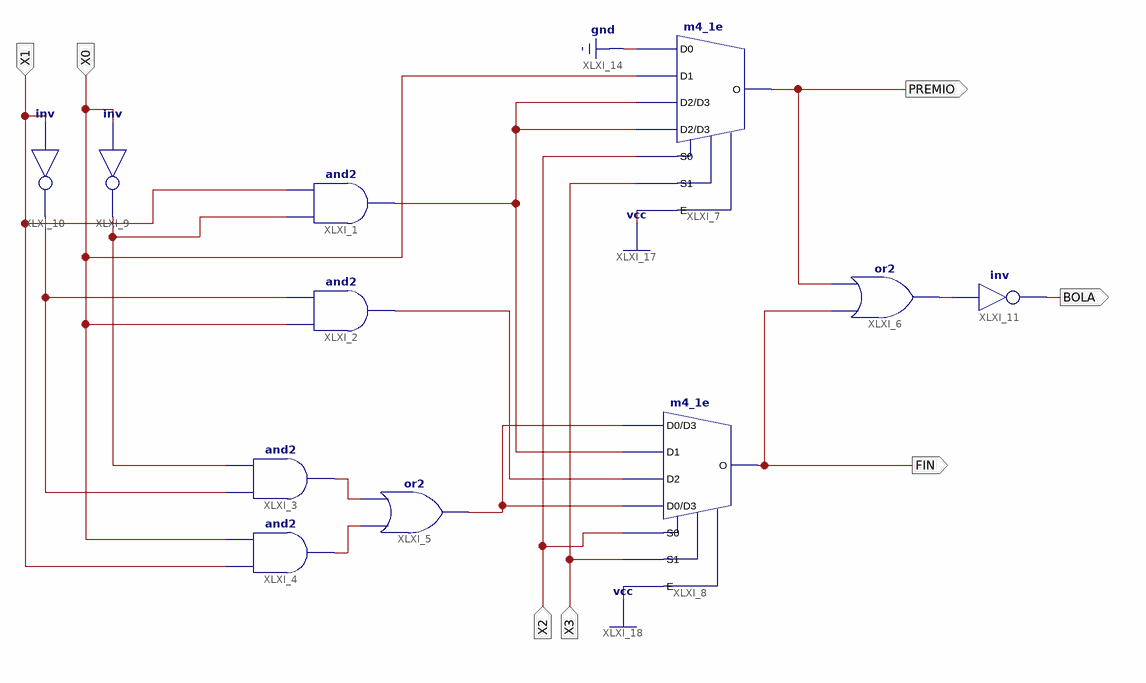
[diagram p0: schematic sheet 1]
// Xilinx ISE schematic p2ej2_montaje.sch (spartan3) as structural Verilog: 11 symbols, 7 ports
module p2ej2_montaje (
  input  X1,
  input  X0,
  input  X2,
  input  X3,
  output PREMIO,
  output FIN,
  output BOLA
);

  wire XLXN_2, XLXN_3, XLXN_7, XLXN_11, XLXN_12, XLXN_14, XLXN_16, XLXN_18;

  and XLXI_1 (XLXN_14, XLXN_12, X1);
  and XLXI_2 (XLXN_16, X0, XLXN_11);
  and XLXI_3 (XLXN_2, XLXN_11, XLXN_12);
  and XLXI_4 (XLXN_3, X1, X0);
  or XLXI_5 (XLXN_18, XLXN_3, XLXN_2);
  m4_1e XLXI_7 (.D0(1'b0), .D1(X0), .D2(XLXN_14), .D3(XLXN_14), .E(1'b1), .S0(X2), .S1(X3), .O(PREMIO));
  m4_1e XLXI_8 (.D0(XLXN_18), .D1(XLXN_14), .D2(XLXN_16), .D3(XLXN_18), .E(1'b1), .S0(X2), .S1(X3), .O(FIN));
  not XLXI_9 (XLXN_12, X0);
  not XLXI_10 (XLXN_11, X1);
  or XLXI_6 (XLXN_7, FIN, PREMIO);
  not XLXI_11 (BOLA, XLXN_7);
endmodule
